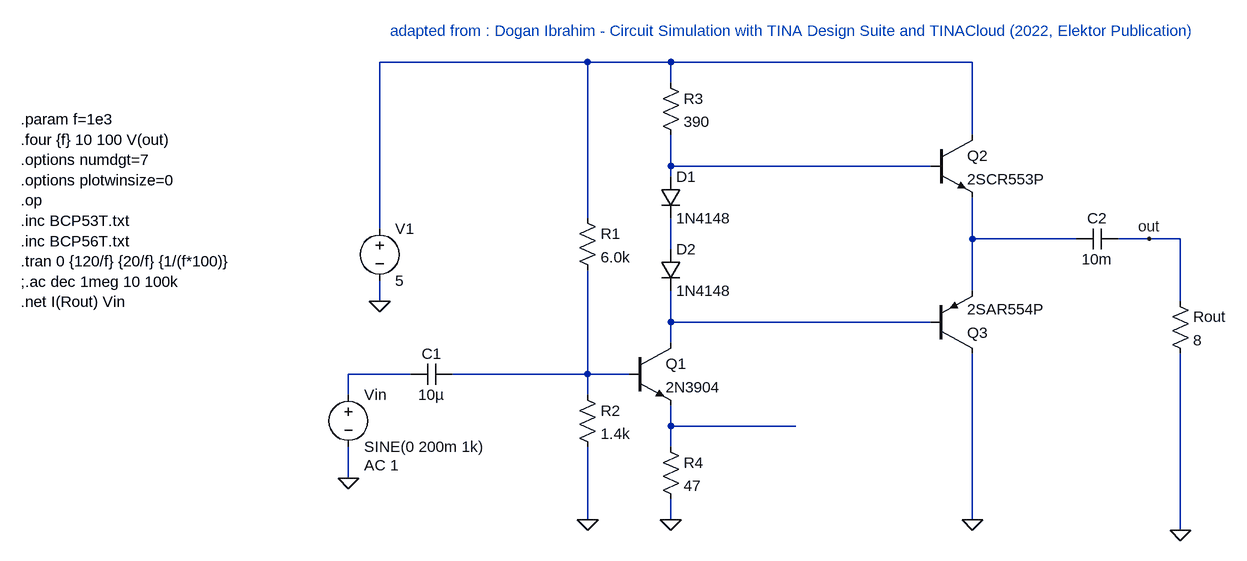
[diagram p0: schematic TINA_5V.asc]
TINA_5V.asc, the LTspice schematic file:
Version 4
SHEET 1 1316 680
WIRE 256 -192 -64 -192
WIRE 384 -192 256 -192
WIRE 848 -192 384 -192
WIRE 384 -160 384 -192
WIRE 848 -80 848 -192
WIRE 384 -32 384 -80
WIRE 784 -32 384 -32
WIRE 384 -16 384 -32
WIRE 256 48 256 -192
WIRE -64 64 -64 -192
WIRE 848 80 848 16
WIRE 1008 80 848 80
WIRE 1120 80 1072 80
WIRE 1168 80 1120 80
WIRE 384 96 384 48
WIRE 848 160 848 80
WIRE -64 176 -64 144
WIRE 1168 176 1168 80
WIRE 384 208 384 160
WIRE 784 208 384 208
WIRE 384 240 384 208
WIRE -16 288 -112 288
WIRE 256 288 256 128
WIRE 256 288 48 288
WIRE 320 288 256 288
WIRE -112 320 -112 288
WIRE 256 320 256 288
WIRE 384 368 384 336
WIRE 576 368 384 368
WIRE 384 400 384 368
WIRE -112 448 -112 400
WIRE 256 512 256 400
WIRE 384 512 384 480
WIRE 848 512 848 256
WIRE 1168 528 1168 256
FLAG -64 176 0
FLAG -112 448 0
FLAG 256 512 0
FLAG 384 512 0
FLAG 848 512 0
FLAG 1168 528 0
FLAG 1120 80 out
DATAFLAG 928 80 ""
DATAFLAG 608 -32 ""
DATAFLAG 592 208 ""
DATAFLAG 144 288 ""
DATAFLAG 480 368 ""
SYMBOL voltage -64 48 R0
SYMATTR InstName V1
SYMATTR Value 5
SYMBOL res 240 32 R0
SYMATTR InstName R1
SYMATTR Value 6.0k
SYMBOL res 240 304 R0
SYMATTR InstName R2
SYMATTR Value 1.4k
SYMBOL npn 320 240 R0
SYMATTR InstName Q1
SYMATTR Value 2N3904
SYMBOL npn 784 -80 R0
SYMATTR InstName Q2
SYMATTR Value 2SCR553P
SYMBOL pnp 784 256 M180
SYMATTR InstName Q3
SYMATTR Value 2SAR554P
SYMBOL res 368 -176 R0
SYMATTR InstName R3
SYMATTR Value 390
SYMBOL res 368 384 R0
SYMATTR InstName R4
SYMATTR Value 47
SYMBOL res 1152 160 R0
SYMATTR InstName Rout
SYMATTR Value 8
SYMBOL voltage -112 304 R0
WINDOW 123 24 124 Left 2
WINDOW 39 0 0 Left 0
SYMATTR InstName Vin
SYMATTR Value SINE(0 200m 1k)
SYMATTR Value2 AC 1
SYMBOL cap 48 272 R90
WINDOW 0 0 32 VBottom 2
WINDOW 3 32 32 VTop 2
SYMATTR InstName C1
SYMATTR Value 10µ
SYMBOL cap 1072 64 R90
WINDOW 0 0 32 VBottom 2
WINDOW 3 32 32 VTop 2
SYMATTR InstName C2
SYMATTR Value 10m
SYMBOL diode 368 -16 R0
SYMATTR InstName D1
SYMATTR Value 1N4148
SYMBOL diode 368 96 R0
SYMATTR InstName D2
SYMATTR Value 1N4148
TEXT -48 -240 Left 2 ;adapted from : Dogan Ibrahim - Circuit Simulation with TINA Design Suite and TINACloud (2022, Elektor Publication)
TEXT -616 -104 Left 2 !.param f=1e3\n.four {f} 10 100 V(out)\n.options numdgt=7\n.options plotwinsize=0\n.op\n.inc BCP53T.txt\n.inc BCP56T.txt\n.tran 0 {120/f} {20/f} {1/(f*100)}\n;.ac dec 1meg 10 100k\n.net I(Rout) Vin

The netlist it stands for:
* TINA_5V.asc
V1 N001 0 5
R1 N001 N007 6.0k
R2 N007 0 1.4k
Q1 N005 N007 N008 0 2N3904
Q2 N001 N002 N003 0 2SCR553P
Q3 0 N005 N003 0 2SAR554P
R3 N001 N002 390
R4 N008 0 47
Rout out 0 8
Vin N006 0 SINE(0 200m 1k) AC 1
C1 N007 N006 10µ
C2 out N003 10m
D1 N002 N004 1N4148
D2 N004 N005 1N4148
.model D D
.lib standard.dio
.model NPN NPN
.model PNP PNP
.lib standard.bjt
* adapted from : Dogan Ibrahim - Circuit Simulation with TINA Design Suite and TINACloud (2022, Elektor Publication)
.param f=1e3
.four {f} 10 100 V(out)
.options numdgt=7
.options plotwinsize=0
.op
.inc BCP53T.txt
.inc BCP56T.txt
.tran 0 {120/f} {20/f} {1/(f*100)}
;.ac dec 1meg 10 100k
.net I(Rout) Vin
.backanno
.end